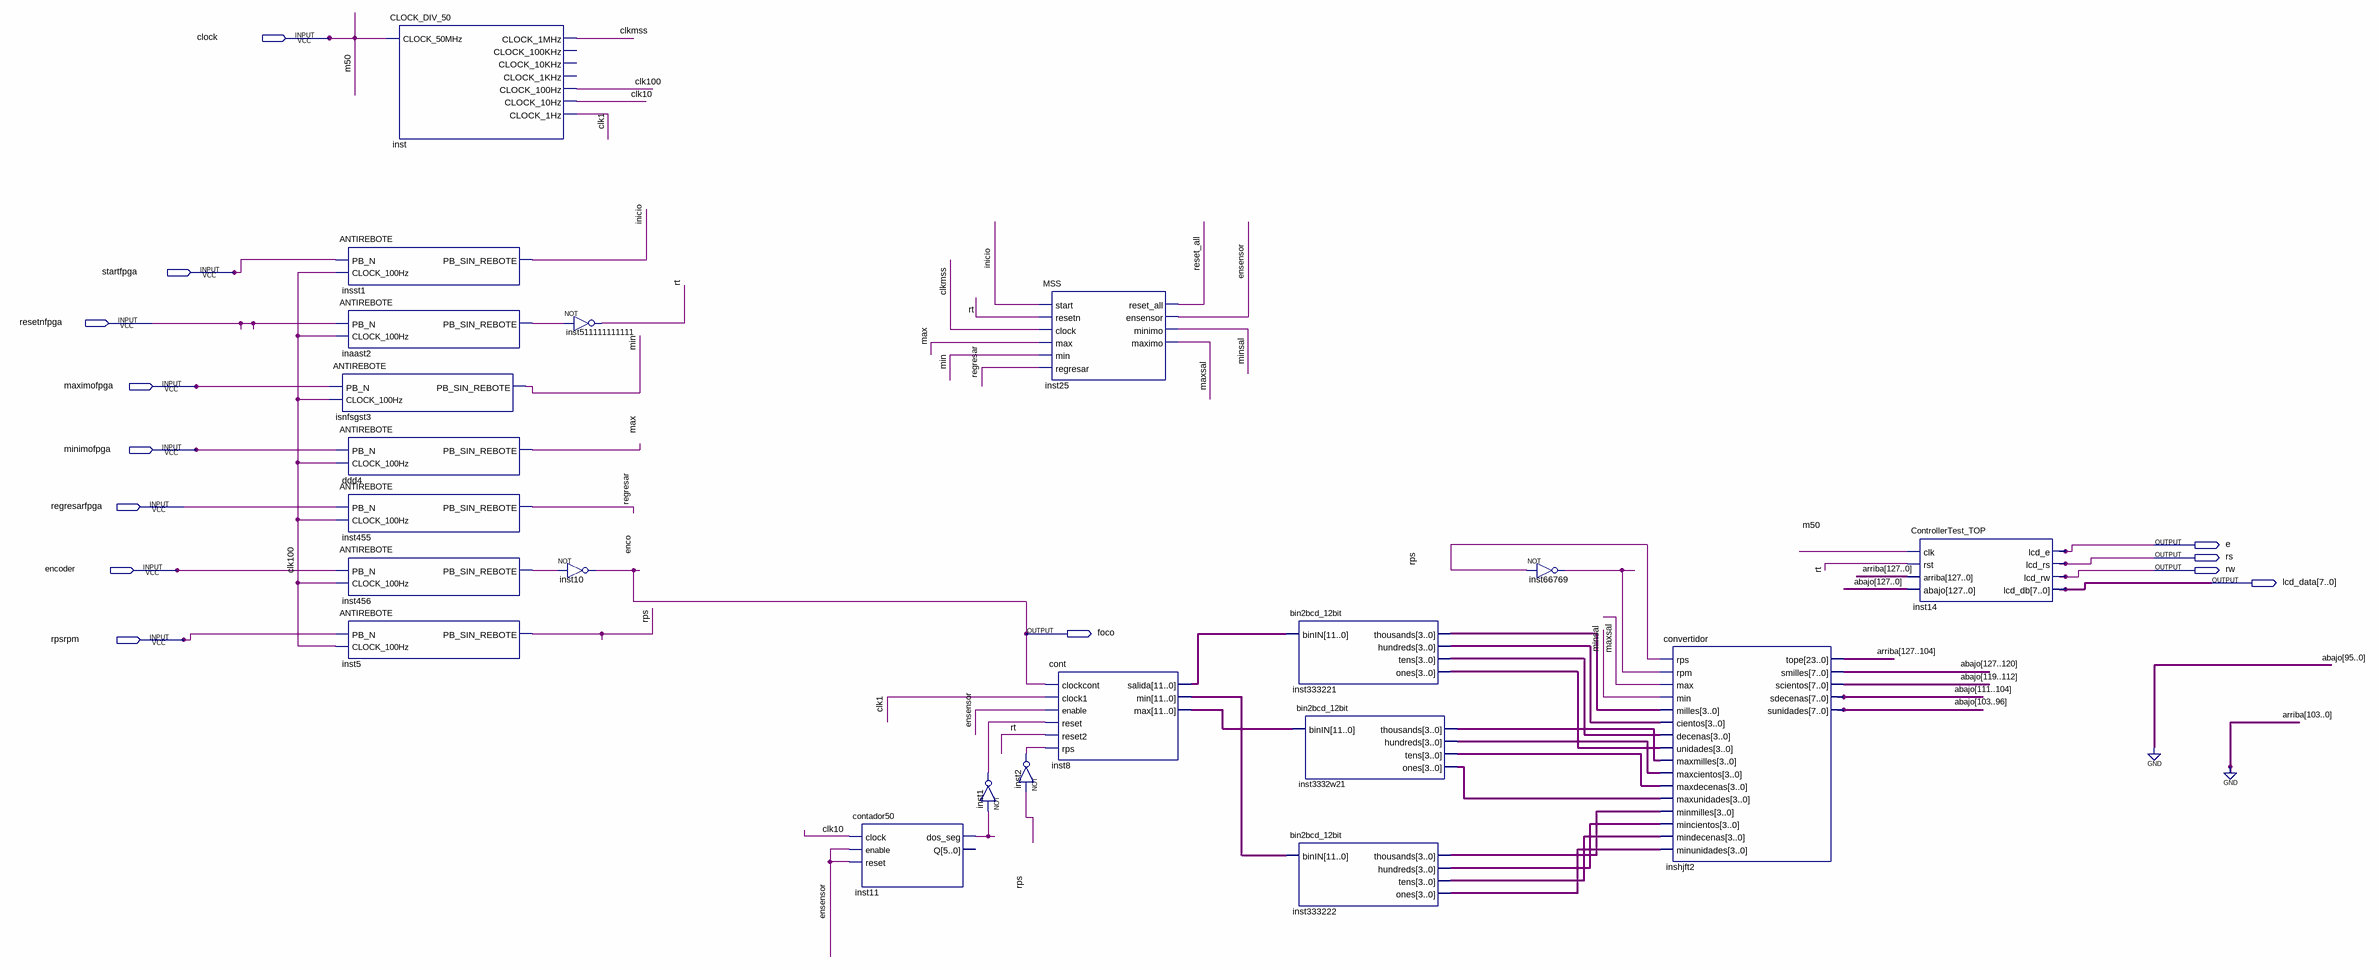
[diagram p0: schematic sheet]
// Quartus schematic diagrama.bdf as structural Verilog: 21 symbols, 13 pins
module diagrama (
  input  clock,
  input  startfpga,
  input  resetnfpga,
  input  maximofpga,
  input  minimofpga,
  input  regresarfpga,
  input  encoder,
  input  rpsrpm,
  output e,
  output rs,
  output rw,
  output [7:0] lcd_data,
  output foco
);

  wire clk1, clk10, clk100, clkmss, ensensor, inaast2_pb_sin_rebote, inicio, inst1_out, inst2_out,
       inst11_dos_seg, inst456_pb_sin_rebote, inst66769_out, max, maxsal, min, minsal, regresar, reset_all,
       rps, rt;
  wire [3:0] inst3332w21_hundreds, inst3332w21_ones, inst3332w21_tens, inst3332w21_thousands,
       inst333221_hundreds, inst333221_ones, inst333221_tens, inst333221_thousands, inst333222_hundreds,
       inst333222_ones, inst333222_tens, inst333222_thousands;
  wire [11:0] inst8_max, inst8_min, inst8_salida;
  wire [127:96] abajo;
  wire [127:104] arriba;

  ANTIREBOTE insst1 (.PB_N(startfpga), .CLOCK_100Hz(clk100), .PB_SIN_REBOTE(inicio));
  ANTIREBOTE inaast2 (.PB_N(resetnfpga), .CLOCK_100Hz(clk100), .PB_SIN_REBOTE(inaast2_pb_sin_rebote));
  ANTIREBOTE isnfsgst3 (.PB_N(maximofpga), .CLOCK_100Hz(clk100), .PB_SIN_REBOTE(min));
  ANTIREBOTE ddd4 (.PB_N(minimofpga), .CLOCK_100Hz(clk100), .PB_SIN_REBOTE(max));
  ANTIREBOTE inst455 (.PB_N(regresarfpga), .CLOCK_100Hz(clk100), .PB_SIN_REBOTE(regresar));
  ANTIREBOTE inst456 (.PB_N(encoder), .CLOCK_100Hz(clk100), .PB_SIN_REBOTE(inst456_pb_sin_rebote));
  ANTIREBOTE inst5 (.PB_N(rpsrpm), .CLOCK_100Hz(clk100), .PB_SIN_REBOTE(rps));
  CLOCK_DIV_50 inst (
    .CLOCK_50MHz(clock), .CLOCK_1MHz(clkmss), .CLOCK_100Hz(clk100), .CLOCK_10Hz(clk10), .CLOCK_1Hz(clk1));  // open: CLOCK_100KHz, CLOCK_10KHz, CLOCK_1KHz
  not inst511111111111 (rt, inaast2_pb_sin_rebote);
  not inst10 (foco, inst456_pb_sin_rebote);
  contador50 inst11 (.clock(clk10), .enable(ensensor), .reset(ensensor), .dos_seg(inst11_dos_seg));  // open: Q
  not inst1 (inst1_out, inst11_dos_seg);
  not inst2 (inst2_out, rps);
  MSS inst25 (
    .start(inicio), .resetn(rt), .clock(clkmss), .max(max), .min(min), .regresar(regresar),
    .reset_all(reset_all), .ensensor(ensensor), .minimo(minsal), .maximo(maxsal));
  cont inst8 (
    .clockcont(foco), .clock1(clk1), .enable(ensensor), .reset(inst1_out), .reset2(rt), .rps(inst2_out),
    .salida(inst8_salida), .min(inst8_min), .max(inst8_max));
  bin2bcd_12bit inst333221 (
    .binIN(inst8_salida), .thousands(inst333221_thousands), .hundreds(inst333221_hundreds),
    .tens(inst333221_tens), .ones(inst333221_ones));
  bin2bcd_12bit inst333222 (
    .binIN(inst8_min), .thousands(inst333222_thousands), .hundreds(inst333222_hundreds),
    .tens(inst333222_tens), .ones(inst333222_ones));
  bin2bcd_12bit inst3332w21 (
    .binIN(inst8_max), .thousands(inst3332w21_thousands), .hundreds(inst3332w21_hundreds),
    .tens(inst3332w21_tens), .ones(inst3332w21_ones));
  not inst66769 (inst66769_out, rps);
  convertidor inshjft2 (
    .rps(rps), .rpm(inst66769_out), .max(maxsal), .min(minsal), .milles(inst333221_thousands),
    .cientos(inst333221_hundreds), .decenas(inst333221_tens), .unidades(inst333221_ones),
    .maxmilles(inst3332w21_thousands), .maxcientos(inst3332w21_hundreds), .maxdecenas(inst3332w21_tens),
    .maxunidades(inst3332w21_ones), .minmilles(inst333222_thousands), .mincientos(inst333222_hundreds),
    .mindecenas(inst333222_tens), .minunidades(inst333222_ones), .tope(arriba), .smilles(abajo[127:120]),
    .scientos(abajo[119:112]), .sdecenas(abajo[111:104]), .sunidades(abajo[103:96]));
  ControllerTest_TOP inst14 (
    .clk(clock), .rst(rt), .arriba({arriba, {104{1'b0}}}), .abajo({abajo, {96{1'b0}}}), .lcd_e(e),
    .lcd_rs(rs), .lcd_rw(rw), .lcd_db(lcd_data));

  // Other names for the same wires on the sheet: enco = foco; m50 = clock
endmodule
